# Altium schematic sheet Sheet3.SchDoc: Наименование
size 420 x 297 mm; ApprovedBy: Vasil; CheckedBy: Vasil; Author: Vasil; CompanyName: Vasil; DrawnBy: n.a.; Engineer: Vasil; SheetNumber: 3; SheetTotal: 5; PageSetup: Record=PageOptions|CenterHorizontal=True|CenterVertical=True|PrintScale=0.94|XCorrection=1.00|YCorrection=1.00|PrintKind=1|BorderSize=5000000|LeftOffset=0|BottomOffset=0|Orientation=1|PaperLength=1000|PaperWidth=1000|Scale=100|PaperSource=7|PrintQuality=-4|MediaType=1|DitherType=10|PaperKind=A4|PrintScaleMode=1; DecimalNumber: 000.00006.001.VG; HeadOfSector: n.a.; MainDevice: HW; Name: CNC_interfaces_board; DocumentName: Sheet1.SCHDOC
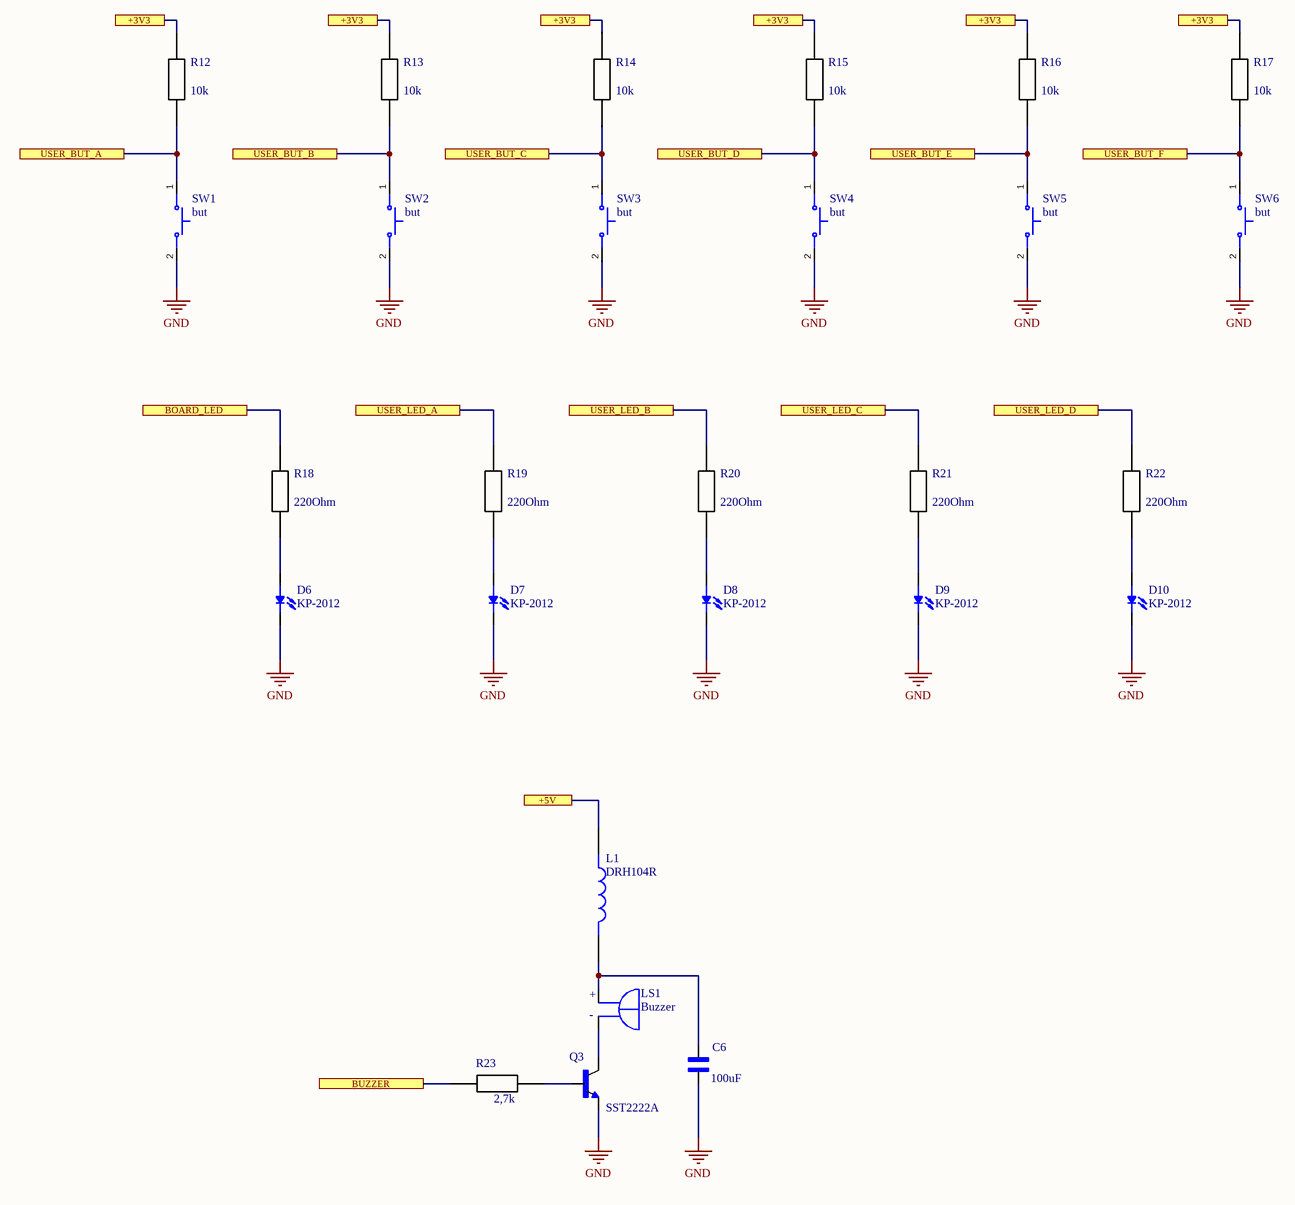
[diagram p0: Sheet3.SchDoc]

## Parts
C6  100uF  [*CAPC3326X230N]
D6  KP-2012  [SMD 0805 LED-Y]
D7  KP-2012  [SMD 0805 LED-Y]
D8  KP-2012  [SMD 0805 LED-Y]
D9  KP-2012  [SMD 0805 LED-Y]
D10  KP-2012  [SMD 0805 LED-Y]
L1  DRH104R  [DRH104R]
LS1  Buzzer  [SMD 1206 RES]
Q3  SST2222A  [SOT-23-3]
R12  10k  [SMD 0805]
R13  10k  [SMD 0805]
R14  10k  [SMD 0805]
R15  10k  [SMD 0805]
R16  10k  [SMD 0805]
R17  10k  [SMD 0805]
R18  220Ohm  [SMD 0805]
R19  220Ohm  [SMD 0805]
R20  220Ohm  [SMD 0805]
R21  220Ohm  [SMD 0805]
R22  220Ohm  [SMD 0805]
R23  2,7k  [SMD 0805]
SW1  but  [SW_KSR221GLFS]
SW2  but  [SW_KSR221GLFS]
SW3  but  [SW_KSR221GLFS]
SW4  but  [SW_KSR221GLFS]
SW5  but  [SW_KSR221GLFS]
SW6  but  [SW_KSR221GLFS]

## Ports
+3V3, +5V, BOARD_LED, BUZZER, USER_BUT_A, USER_BUT_B, USER_BUT_C, USER_BUT_D, USER_BUT_E, USER_BUT_F, USER_LED_A, USER_LED_B, USER_LED_C, USER_LED_D

## Nets
GND: C6.1 D6.C D7.C D8.C D9.C D10.C Q3.1(E) SW1.2 SW2.2 SW3.2 SW4.2 SW5.2 SW6.2
+3V3: R12.1 R13.1 R14.1 R15.1 R16.1 R17.1 ; port +3V3
+5V: L1.1 ; port +5V
BOARD_LED: R18.1 ; port BOARD_LED
BUZZER: R23.1 ; port BUZZER
USER_BUT_A: R12.2 SW1.1 ; port USER_BUT_A
USER_BUT_B: R13.2 SW2.1 ; port USER_BUT_B
USER_BUT_C: R14.2 SW3.1 ; port USER_BUT_C
USER_BUT_D: R15.2 SW4.1 ; port USER_BUT_D
USER_BUT_E: R16.2 SW5.1 ; port USER_BUT_E
USER_BUT_F: R17.2 SW6.1 ; port USER_BUT_F
USER_LED_A: R19.1 ; port USER_LED_A
USER_LED_B: R20.1 ; port USER_LED_B
USER_LED_C: R21.1 ; port USER_LED_C
USER_LED_D: R22.1 ; port USER_LED_D
NetC6_2: C6.2 L1.2 LS1.2(NEG)
NetD6_A: D6.A R18.2
NetD7_A: D7.A R19.2
NetD8_A: D8.A R20.2
NetD9_A: D9.A R21.2
NetD10_A: D10.A R22.2
NetLS1_1: LS1.1(POS) Q3.3(C)
NetQ3_2: Q3.2(B) R23.2

## Notes on the sheet
- Перв.примен.
- Справ.№
- Подп. и дата
- Инв.№ дубл.
- Взам.инв.№
- Подп.и дата
- Разраб.
- Изм.
- Лист
- № докум.
- Подп.
- Дата
- Лит.
- Масштаб
- Масса
- Т.контр.
- Пров.
- СХЕМА   ЭЛЕКТРИЧЕСКАЯ
- ПРИНЦИПИАЛЬНАЯ
- Листов
- Инв.№ подл.
- Утв.
- Н.контр.
- Нач.сект.
- Формат  A3
- (in symbol Buzzer) +; -

## Library data of the parts
C6 = CL32B106KLJNNNE: C1210 10uF 35V X7R; Manufacturer: SAMSUNG ELECTRO-MECHANICS; HelpURL: https://store.comet.bg/Catalogue/Product/36844/; Model: CL32B106KLJNNNE; Case: SMD 1210; Value: 100uF
D6-D10 = KP-2012: LED 2.0x1.25mm, 50-160 mcd@20mA, W.Clear, 120°; MP: SMLMN2WB1CW1C; MF: Rohm Semiconductor; SnapEDA_Link: https://www.snapeda.com/parts/SMLMN2WB1CW1C/Rohm/view-part/3217279/?ref=snap; Availability: Unavailable; Value: *; Price: None; Package: 0805 Rohm Semiconductor
L1 = DRH104R: Inductor with Inductance: 1.5uH Tol. +/-30%, Package: 3939 (100100); MP: 1274AS-H-1R5N=P3; MF: Murata; Purchase-URL: https://pricing.snapeda.com/search/part/1274AS-H-1R5N=P3/?ref=eda; Package: NONSTANDARD; Value: *; SnapEDA_Link: https://www.snapeda.com/parts/1274AS-H-1R5N=P3/Murata/view-part/4549270/?ref=snap; Price: None; Availability: Warning; Check_prices: https://www.snapeda.com/parts/1274AS-H-1R5N=P3/Murata/view-part/4549270/?ref=eda
LS1 = Buzzer: MP: KPEG242-5V; Availability: Unavailable; Price: None; Package: None; Value: *
Q3 = SST2222A: Transistor NPN 40V 600mA 300MHz 350mW; Manufacturer: ROHM Semiconductor; Case: SOT-23-3 SST3; HelpURL: https://store.comet.bg/Catalogue/Product/23715/; Model: SST2222A
R12-R23 = Resistor_1: RES; HelpURL: https://store.comet.bg/Catalogue/RES/Resistors/#eyJpcHAiOiIxMDAiLCJtIjoiIn0%3D
  R12-R17: Value: 10k
  R18-R22: Value: 220Ohm
  R23: Value: 2,7k
SW1-SW6 = KSR221GLFS: Tactile Switch 2p SPST-NO 50mA/32V 6x3.8x2.5mm; MF: C&K; MP: KSR221GLFS; Package: 6x3.8x2.5mm; URL: https://store.comet.bg/Catalogue/Product/17512/